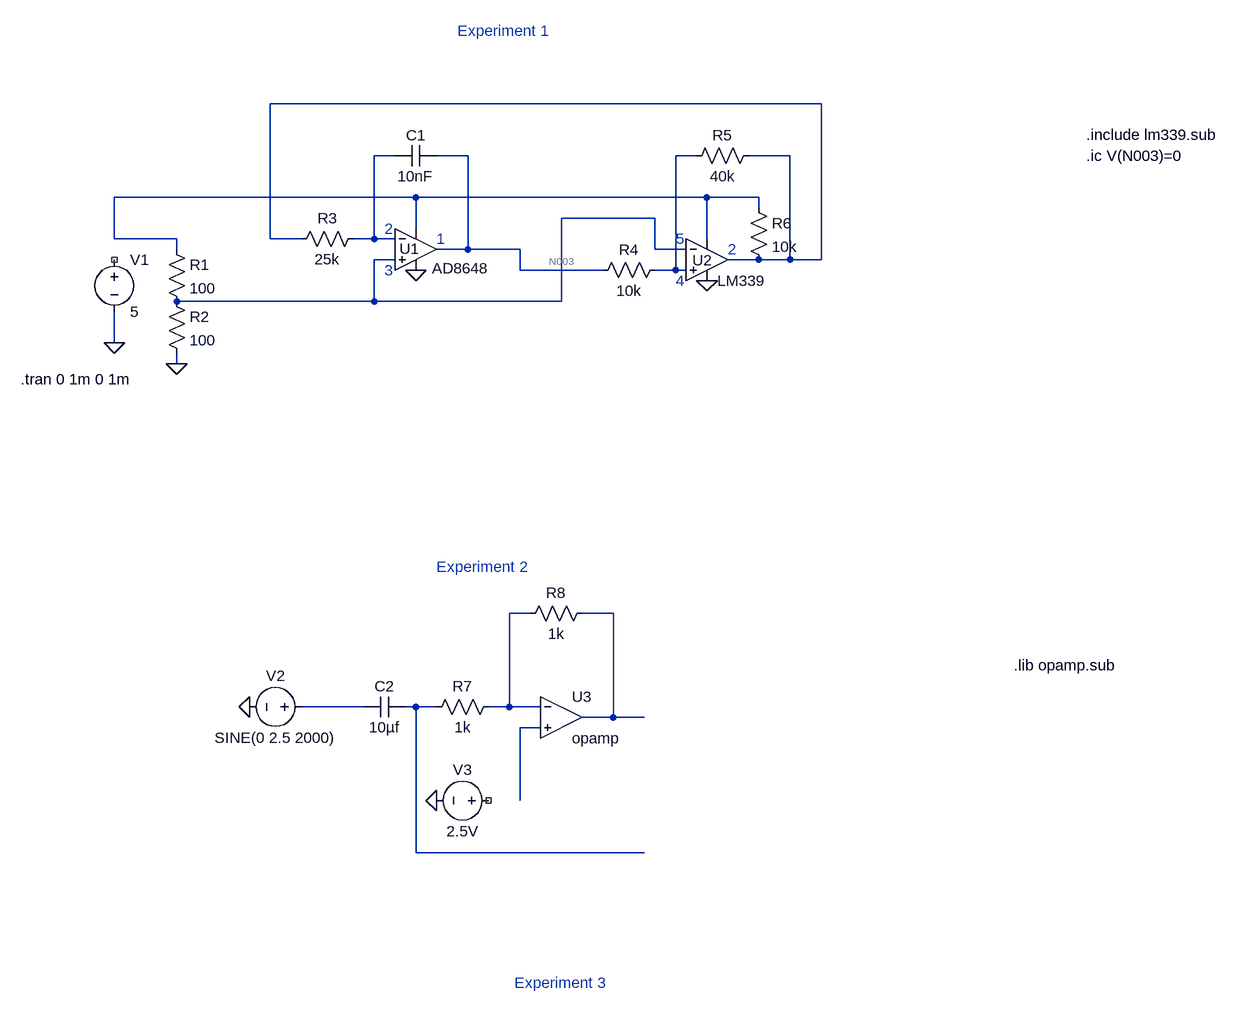
[diagram p0: schematic all diagrams.asc]
all diagrams.asc, the LTspice schematic file:
Version 4
SHEET 1 1304 1448
WIRE 672 80 -176 80
WIRE 16 160 -16 160
WIRE 128 160 80 160
WIRE 480 160 448 160
WIRE 624 160 560 160
WIRE 48 224 -416 224
WIRE 496 224 48 224
WIRE 576 224 496 224
WIRE 576 240 576 224
WIRE 416 256 272 256
WIRE 48 272 48 224
WIRE -416 288 -416 224
WIRE -320 288 -416 288
WIRE -176 288 -176 80
WIRE -128 288 -176 288
WIRE -16 288 -16 160
WIRE -16 288 -48 288
WIRE 16 288 -16 288
WIRE 496 288 496 224
WIRE -320 304 -320 288
WIRE 128 304 128 160
WIRE 128 304 80 304
WIRE 208 304 128 304
WIRE 416 304 416 256
WIRE 464 304 416 304
WIRE 16 320 -16 320
WIRE 576 320 528 320
WIRE 624 320 624 160
WIRE 624 320 576 320
WIRE 672 320 672 80
WIRE 672 320 624 320
WIRE 208 336 208 304
WIRE 336 336 208 336
WIRE 448 336 448 160
WIRE 448 336 416 336
WIRE 464 336 448 336
WIRE -16 384 -16 320
WIRE -16 384 -320 384
WIRE 272 384 272 256
WIRE 272 384 -16 384
WIRE -416 448 -416 400
WIRE -320 480 -320 464
WIRE 224 864 192 864
WIRE 352 864 304 864
WIRE -32 1008 -128 1008
WIRE 48 1008 32 1008
WIRE 80 1008 48 1008
WIRE 192 1008 192 864
WIRE 192 1008 160 1008
WIRE 240 1008 192 1008
WIRE 352 1024 352 864
WIRE 352 1024 304 1024
WIRE 400 1024 352 1024
WIRE 240 1040 208 1040
WIRE 208 1152 208 1040
WIRE 48 1232 48 1008
WIRE 400 1232 48 1232
FLAG -416 448 0
FLAG -320 480 0
FLAG 48 336 0
FLAG 496 352 0
FLAG -208 1008 0
FLAG 80 1152 0
SYMBOL OpAmps\\AD8648 48 240 R0
WINDOW 0 -25 63 Left 2
WINDOW 3 25 93 Left 2
SYMATTR InstName U1
SYMBOL voltage -416 304 R0
WINDOW 123 0 0 Left 0
WINDOW 39 0 0 Left 0
SYMATTR InstName V1
SYMATTR Value 5
SYMBOL res -336 288 R0
SYMATTR InstName R1
SYMATTR Value 100
SYMBOL res -336 368 R0
SYMATTR InstName R2
SYMATTR Value 100
SYMBOL cap 80 144 R90
WINDOW 0 0 32 VBottom 2
WINDOW 3 32 32 VTop 2
SYMATTR InstName C1
SYMATTR Value 10nF
SYMBOL res -32 272 R90
WINDOW 0 0 56 VBottom 2
WINDOW 3 32 56 VTop 2
SYMATTR InstName R3
SYMATTR Value 25k
SYMBOL res 432 320 R90
WINDOW 0 0 56 VBottom 2
WINDOW 3 32 56 VTop 2
SYMATTR InstName R4
SYMATTR Value 10k
SYMBOL res 576 144 R90
WINDOW 0 0 56 VBottom 2
WINDOW 3 32 56 VTop 2
SYMATTR InstName R5
SYMATTR Value 40k
SYMBOL res 560 224 R0
SYMATTR InstName R6
SYMATTR Value 10k
SYMBOL OpAmps\\opamp2 496 256 R0
WINDOW 0 -22 65 Left 2
SYMATTR InstName U2
SYMATTR Value LM339
SYMATTR SpiceModel lm339
SYMBOL cap 32 992 R90
WINDOW 0 0 32 VBottom 2
WINDOW 3 32 32 VTop 2
SYMATTR InstName C2
SYMATTR Value 10µf
SYMBOL res 176 992 R90
WINDOW 0 0 56 VBottom 2
WINDOW 3 32 56 VTop 2
SYMATTR InstName R7
SYMATTR Value 1k
SYMBOL res 320 848 R90
WINDOW 0 0 56 VBottom 2
WINDOW 3 32 56 VTop 2
SYMATTR InstName R8
SYMATTR Value 1k
SYMBOL OpAmps\\opamp 272 960 R0
SYMATTR InstName U3
SYMBOL voltage -112 1008 R90
WINDOW 0 -32 56 VBottom 2
WINDOW 3 32 56 VTop 2
WINDOW 123 0 0 Left 0
WINDOW 39 0 0 Left 0
SYMATTR InstName V2
SYMATTR Value SINE(0 2.5 2000)
SYMBOL voltage 176 1152 R90
WINDOW 0 -32 56 VBottom 2
WINDOW 3 32 56 VTop 2
SYMATTR InstName V3
SYMATTR Value 2.5V
TEXT 1080 128 Left 2 !.include lm339.sub
TEXT -560 504 Left 2 !.tran 0 1m 0 1m
TEXT 1080 160 Left 2 !.ic V(N003)=0
TEXT 0 272 Left 2 ;2
TEXT 0 336 Left 2 ;3
TEXT 80 288 Left 2 ;1
TEXT 448 288 Left 2 ;5
TEXT 448 352 Left 2 ;4
TEXT 528 304 Left 2 ;2
TEXT 968 944 Left 2 !.lib opamp.sub
TEXT 112 -32 Left 2 ;Experiment 1
TEXT 80 792 Left 2 ;Experiment 2
TEXT 200 1432 Left 2 ;Experiment 3

The netlist it stands for:
* all diagrams.asc
XU1 N006 N002 N005 0 N003 AD8648  ; pins In+ In- V+ V- OUT
V1 NC_01 0 5
R1 N005 N006 100
R2 N006 0 100
C1 N003 N002 10nF
R3 N002 N001 25k
R4 N004 N003 10k
R5 N001 N004 40k
R6 N005 N001 10k
XU2 N004 N006 N005 0 N001 lm339 LM339  ; pins In+ In- V+ V- OUT
C2 N010 N009 10µf
R7 N007 N010 1k
R8 N008 N007 1k
XU3 N007 N011 N008 opamp Aol=100K GBW=10Meg  ; pins invin noninvin out
V2 N009 0 SINE(0 2.5 2000)
V3 NC_02 0 2.5V
.include lm339.sub
.tran 0 1m 0 1m
.ic V(N003)=0
* 2
* 3
* 1
* 5
* 4
* 2
.lib opamp.sub
* Experiment 1
* Experiment 2
* Experiment 3
.lib ADI.lib
.backanno
.end